# EAGLE design overall_pcb_1_1 (EAGLE 8.3.2)
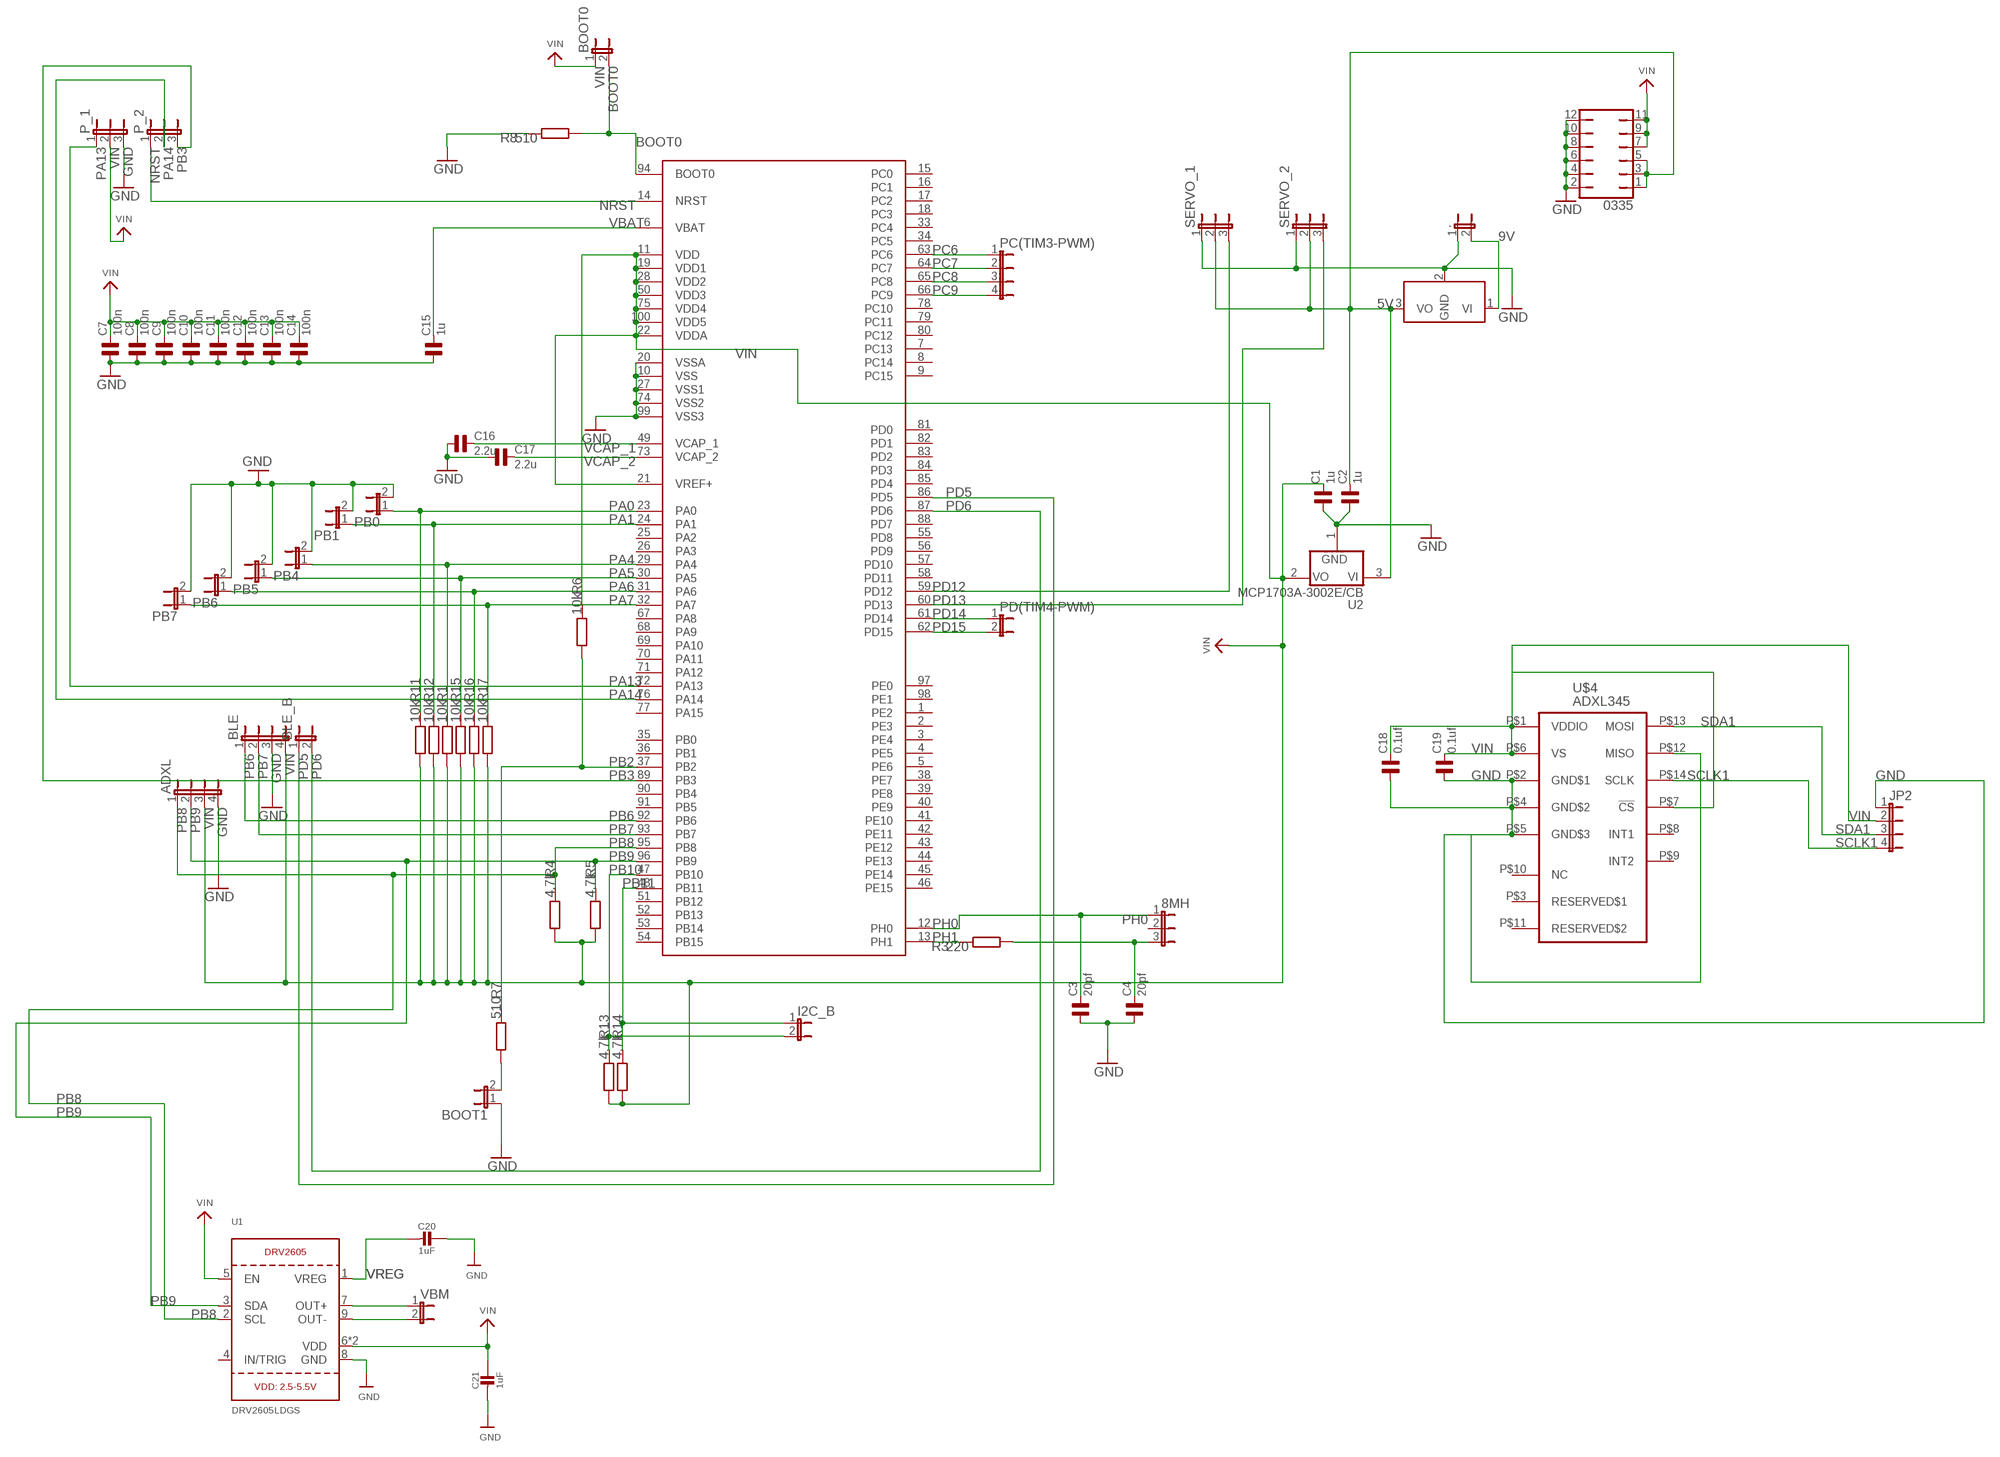
[diagram p0: schematic, sheet 1]

## Parts
8MH  JP2E  [JP2]
0335  JP6Q  [JP6Q]
.  JP1E  [JP1]
ADXL  JP4E  [JP4]
BLE  JP4E  [JP4]
BLE_B  JP1E  [JP1]
BOOT0  JP1E  [JP1]
BOOT1  JP1E  [JP1]
C1  1u  C0805  [0805]
C2  1u  C0805  [0805]
C3  20pf  C0805  [0805]
C4  20pf  C0805  [0805]
C7  100n  C0805  [0805]
C8  100n  C0805  [0805]
C9  100n  C0805  [0805]
C10  100n  C0805  [0805]
C11  100n  C0805  [0805]
C12  100n  C0805  [0805]
C13  100n  C0805  [0805]
C14  100n  C0805  [0805]
C15  1u  C0805  [0805]
C16  2.2u  C0805  [0805]
C17  2.2u  C0805  [0805]
C18  0.1uf  C0805  [0805]
C19  0.1uf  C0805  [0805]
C20  1uF  CAP_CERAMIC0805-NOOUTLINE  [0805-NO]
C21  1uF  CAP_CERAMIC0805-NOOUTLINE  [0805-NO]
I2C_B  JP1E  [JP1]
JP2  JP4E  [JP4]
P_1  JP2E  [JP2]
P_2  JP2E  [JP2]
PB0  JP1E  [JP1]
PB1  JP1E  [JP1]
PB4  JP1E  [JP1]
PB5  JP1E  [JP1]
PB6  JP1E  [JP1]
PB7  JP1E  [JP1]
PC(TIM3-PWM)  JP4E  [JP4]
PD(TIM4-PWM)  JP1E  [JP1]
R1  10k  R-EU_R0805  [R0805]
R3  220  R-EU_R0805  [R0805]
R4  4.7k  R-EU_R0805  [R0805]
R5  4.7k  R-EU_R0805  [R0805]
R6  10k  R-EU_R0805  [R0805]
R7  510  R-EU_R0805  [R0805]
R8  510  R-EU_R0805  [R0805]
R11  10k  R-EU_R0805  [R0805]
R12  10k  R-EU_R0805  [R0805]
R13  4.7k  R-EU_R0805  [R0805]
R14  4.7k  R-EU_R0805  [R0805]
R15  10k  R-EU_R0805  [R0805]
R16  10k  R-EU_R0805  [R0805]
R17  10k  R-EU_R0805  [R0805]
SERVO_1  JP2E  [JP2]
SERVO_2  JP2E  [JP2]
U1  DRV2605LDGS  DRV2605_SOP  [PSOP10]
U2  MCP1703A-3002E/CB  [SOT23A_MICROCHIP_CB]
U$1  STM32F40XSTM32D40X  [LQFP100]
U$2  DCDC_OKI-78SR  [OKI-78SRH]
U$4  ADXL345  [LGA14]
VBM  JP1E  [JP1]

## Nets
5V: 0335.1 0335.3 0335.5 C2.2 SERVO_1.2 SERVO_2.2 U2.3(VI) U$2.3(VO)
9V: ..2 U$2.1(VI)
BOOT0: BOOT0.2 R8.1 U$1.94(BOOT0)
GND: 0335.2 0335.4 0335.6 0335.8 0335.10 0335.12 ..1 ADXL.4 BLE.3 BOOT1.1 C1.1 C2.1 C3.1 C4.1 C7.1 C8.1 C9.1 C10.1 C11.1 C12.1 C13.1 C14.1 C15.1 C16.1 C17.1 C18.1 C19.1 C20.1 C21.2 JP2.1 P_1.3 PB0.2 PB1.2 PB4.2 PB5.2 PB6.2 PB7.2 R8.2 SERVO_1.1 SERVO_2.1 U1.8(GND) U2.1(GND) U$1.10(VSS) U$1.20(VSSA) U$1.27(VSS1) U$1.74(VSS2) U$1.99(VSS3) U$2.2(GND) U$4.P$2(GND$1) U$4.P$4(GND$2) U$4.P$5(GND$3) U$4.P$12(MISO)
N$2: BOOT1.2 R7.1
N$7: 8MH.3 C4.2 R3.1
NRST: P_2.1 U$1.14(NRST)
OUT+: U1.7(OUT+) VBM.1
OUT-: U1.9(OUT-) VBM.2
PA0: PB0.1 R11.2 U$1.23(PA0)
PA1: PB1.1 R12.2 U$1.24(PA1)
PA4: PB4.1 R1.2 U$1.29(PA4)
PA5: PB5.1 R15.2 U$1.30(PA5)
PA6: PB6.1 R16.2 U$1.31(PA6)
PA7: PB7.1 R17.2 U$1.32(PA7)
PA13: P_1.1 U$1.72(PA13)
PA14: P_2.2 U$1.76(PA14)
PB2: R6.1 R7.2 U$1.37(PB2)
PB3: P_2.3 U$1.89(PB3)
PB6: BLE.1 U$1.92(PB6)
PB7: BLE.2 U$1.93(PB7)
PB8: ADXL.1 R4.2 U1.2(SCL) U$1.95(PB8)
PB9: ADXL.2 R5.2 U1.3(SDA) U$1.96(PB9)
PB10: I2C_B.2 R13.2 U$1.47(PB10)
PB11: I2C_B.1 R14.2 U$1.48(PB11)
PC6: PC(TIM3-PWM).1 U$1.63(PC6)
PC7: PC(TIM3-PWM).2 U$1.64(PC7)
PC8: PC(TIM3-PWM).3 U$1.65(PC8)
PC9: PC(TIM3-PWM).4 U$1.66(PC9)
PD5: BLE_B.1 U$1.86(PD5)
PD6: BLE_B.2 U$1.87(PD6)
PD12: SERVO_1.3 U$1.59(PD12)
PD13: SERVO_2.3 U$1.60(PD13)
PD14: PD(TIM4-PWM).1 U$1.61(PD14)
PD15: PD(TIM4-PWM).2 U$1.62(PD15)
PH0: 8MH.1 C3.2 U$1.12(PH0)
PH1: R3.2 U$1.13(PH1)
SCLK1: JP2.4 U$4.P$14(SCLK)
SDA1: JP2.3 U$4.P$13(MOSI)
VBAT: C15.2 U$1.6(VBAT)
VCAP_1: C16.2 U$1.49(VCAP_1)
VCAP_2: C17.2 U$1.73(VCAP_2)
VIN: 0335.7 0335.9 0335.11 ADXL.3 BLE.4 BOOT0.1 C1.2 C7.2 C8.2 C9.2 C10.2 C11.2 C12.2 C13.2 C14.2 C18.2 C19.2 C21.1 JP2.2 P_1.2 R1.1 R4.1 R5.1 R6.2 R11.1 R12.1 R13.1 R14.1 R15.1 R16.1 R17.1 U1.5(EN) U1.6(VDD) U1.10(VDD) U2.2(VO) U$1.11(VDD) U$1.19(VDD1) U$1.21(VREF+) U$1.22(VDDA) U$1.28(VDD2) U$1.50(VDD3) U$1.75(VDD4) U$1.100(VDD5) U$4.P$1(VDDIO) U$4.P$6(VS) U$4.P$7(!CS)
VREG: C20.2 U1.1(VREG)
Unconnected: 8MH.2 U1.4(IN/TRIG) U$1.1(PE2) U$1.2(PE3) U$1.3(PE4) U$1.4(PE5) U$1.5(PE6) U$1.7(PC13) U$1.8(PC14) U$1.9(PC15) U$1.15(PC0) U$1.16(PC1) U$1.17(PC2) U$1.18(PC3) U$1.25(PA2) U$1.26(PA3) U$1.33(PC4) U$1.34(PC5) U$1.35(PB0) U$1.36(PB1) U$1.38(PE7) U$1.39(PE8) U$1.40(PE9) U$1.41(PE10) U$1.42(PE11) U$1.43(PE12) U$1.44(PE13) U$1.45(PE14) U$1.46(PE15) U$1.51(PB12) U$1.52(PB13) U$1.53(PB14) U$1.54(PB15) U$1.55(PD8) U$1.56(PD9) U$1.57(PD10) U$1.58(PD11) U$1.67(PA8) U$1.68(PA9) U$1.69(PA10) U$1.70(PA11) U$1.71(PA12) U$1.77(PA15) U$1.78(PC10) U$1.79(PC11) U$1.80(PC12) U$1.81(PD0) U$1.82(PD1) U$1.83(PD2) U$1.84(PD3) U$1.85(PD4) U$1.88(PD7) U$1.90(PB4) U$1.91(PB5) U$1.97(PE0) U$1.98(PE1) U$4.P$3(RESERVED$1) U$4.P$8(INT1) U$4.P$9(INT2) U$4.P$10(NC) U$4.P$11(RESERVED$2)

## Library data of the parts
8MH P_1 P_2 SERVO_1 SERVO_2 = jumper:JP2E: JUMPER
0335 = jumper:JP6Q: JUMPER
. BLE_B BOOT0 BOOT1 I2C_B PB0 PB1 PB4-PB7 PD(TIM4-PWM) VBM = jumper:JP1E: JUMPER
ADXL BLE JP2 PC(TIM3-PWM) = jumper:JP4E: JUMPER
C1-C4 C7-C19 = capsmd:C0805
C20 C21 = microbuilder:CAP_CERAMIC: Ceramic Capacitors For new designs, use the packages preceded by an '_' character since they are more reliable: The following footprints should be used on most boards: _0402 - Standard footprint for regular board layouts _0603 - Standard footprint for regular board layouts _0805 - Standard footprint for regular board layouts _1206 - Standard footprint for regular board layouts For extremely tight-pitch boards where space is at a premium, the following 'micro-pitch' footprints can be used (smaller pads, no silkscreen outline, etc.): _0402MP - Micro-pitch footprint for very dense/compact boards _0603MP - Micro-pitch footprint for very dense/compact boards _0805MP - Micro-pitch footprint for very dense/compact boards _1206MP - Micro-pitch footprint for very dense/compact boards
R1 R3-R8 R11-R17 = rcl:R-EU_: RESISTOR, European symbol
U1 = microbuilder:DRV2605: DRV2605 - Haptic Driver for ERM/LRA Motors
U2 = MCP1703:MCP1703*02E/CB: MCP1703[A] Series of Voltage Regulators – SOT23A (Microchip CB) (1.2 … 5.0)V, LDO, 16 V Input, 100/150/200/250 mA, Low Quiescent Current Source: http://ww1.microchip.com/downloads/en/DeviceDoc/22049f.pdf http://ww1.microchip.com/downloads/en/DeviceDoc/25122A.pdf Packages: SOT23, Microchip package identifier "CB" (dimensions and recommended land patterns acc. to Microchip) Technologies: MCP1703[A]T-xx02E/CB T : Tape and Reel xx: Output Voltage * 1000 mV; 12|15|18|25|28|30|33|40|50 0 : Extra Feature Code (fixed) 2 : Output volt. Tol.: ±2% (standard) E : Temperature range (−40…+125)°C CB: Package: SOT23A Author: Dipl.-Ing. FH Rainer Bayer HHN Hochschule Heilbronn, rainer.bayer@hs-heilbronn.de Ingenieurbüro ing-rb, mail@ing-rb.de
U$1 = stm32f:STM32F40X: Features • Core: ARM 32-bit Cortex™-M4 CPU with FPU, Adaptive real-time accelerator (ART Accelerator™) allowing 0-wait state execution from Flash memory, frequency up to 168 MHz, memory protection unit, 210 DMIPS/ 1.25 DMIPS/MHz (Dhrystone 2.1), and DSP instructions • Memories – Up to 1 Mbyte of Flash memory – Up to 192+4 Kbytes of SRAM including 64- Kbyte of CCM (core coupled memory) data RAM – Flexible static memory controller supporting Compact Flash, SRAM, PSRAM, NOR and NAND memories • LCD parallel interface, 8080/6800 modes • Clock, reset and supply management – 1.8 V to 3.6 V application supply and I/Os – POR, PDR, PVD and BOR – 4-to-26 MHz crystal oscillator – Internal 16 MHz factory-trimmed RC (1% accuracy) – 32 kHz oscillator for RTC with calibration – Internal 32 kHz RC with calibration • Low power – Sleep, Stop and Standby modes – VBAT supply for RTC, 20×32 bit backup registers + optional 4 KB backup SRAM • 3×12-bit, 2.4 MSPS A/D converters: up to 24 channels and 7.2 MSPS in triple interleaved mode • 2×12-bit D/A converters • General-purpose DMA: 16-stream DMA controller with FIFOs and burst support • Up to 17 timers: up to twelve 16-bit and two 32- bit timers up to 168 MHz, each with up to 4 IC/OC/PWM or pulse counter and quadrature (incremental) encoder input • Debug mode – Serial wire debug (SWD) & JTAG interfaces – Cortex-M4 Embedded Trace Macrocell™ • Up to 140 I/O ports with interrupt capability – Up to 136 fast I/Os up to 84 MHz – Up to 138 5 V-tolerant I/Os • Up to 15 communication interfaces – Up to 3 × I2C interfaces (SMBus/PMBus) – Up to 4 USARTs/2 UARTs (10.5 Mbit/s, ISO 7816 interface, LIN, IrDA, modem control) – Up to 3 SPIs (42 Mbits/s), 2 with muxed full-duplex I2S to achieve audio class accuracy via internal audio PLL or external clock – 2 × CAN interfaces (2.0B Active) – SDIO interface • Advanced connectivity – USB 2.0 full-speed device/host/OTG controller with on-chip PHY – USB 2.0 high-speed/full-speed device/host/OTG controller with dedicated DMA, on-chip full-speed PHY and ULPI – 10/100 Ethernet MAC with dedicated DMA: supports IEEE 1588v2 hardware, MII/RMII • 8- to 14-bit parallel camera interface up to 54 Mbytes/s • True random number generator • CRC calculation unit • 96-bit unique ID • RTC: subsecond accuracy, hardware calendar
U$2 = carrilib:DCDC_OKI-78SR: 4.95W DC/DC Converter Manufacturer: Murata Part Number: OKI-78SR-5/1.5-W36H-C OKI-78SR-3.3/1.5-W36H-C
U$4 = adxl345:ADXL345: 3-Axis, ±2 g/±4 g/±8 g/±16 g Digital Accelerometer

## Board
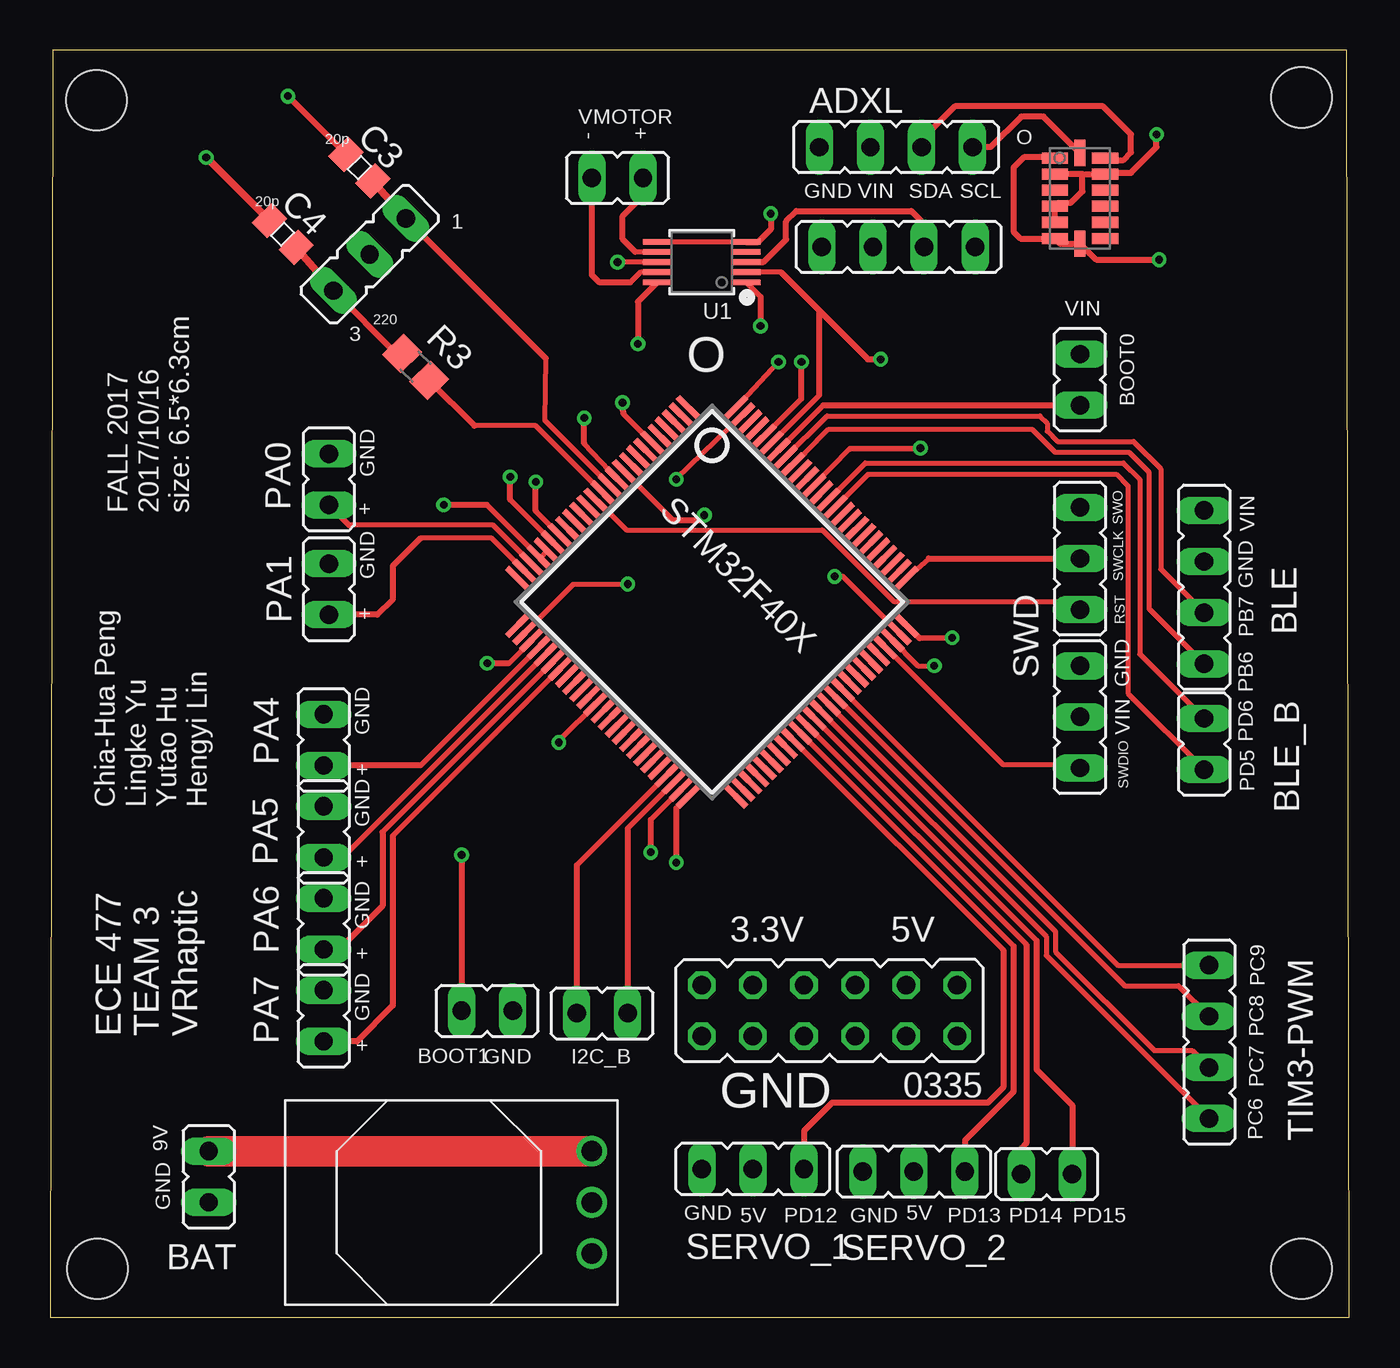
[diagram p1: board, top side]
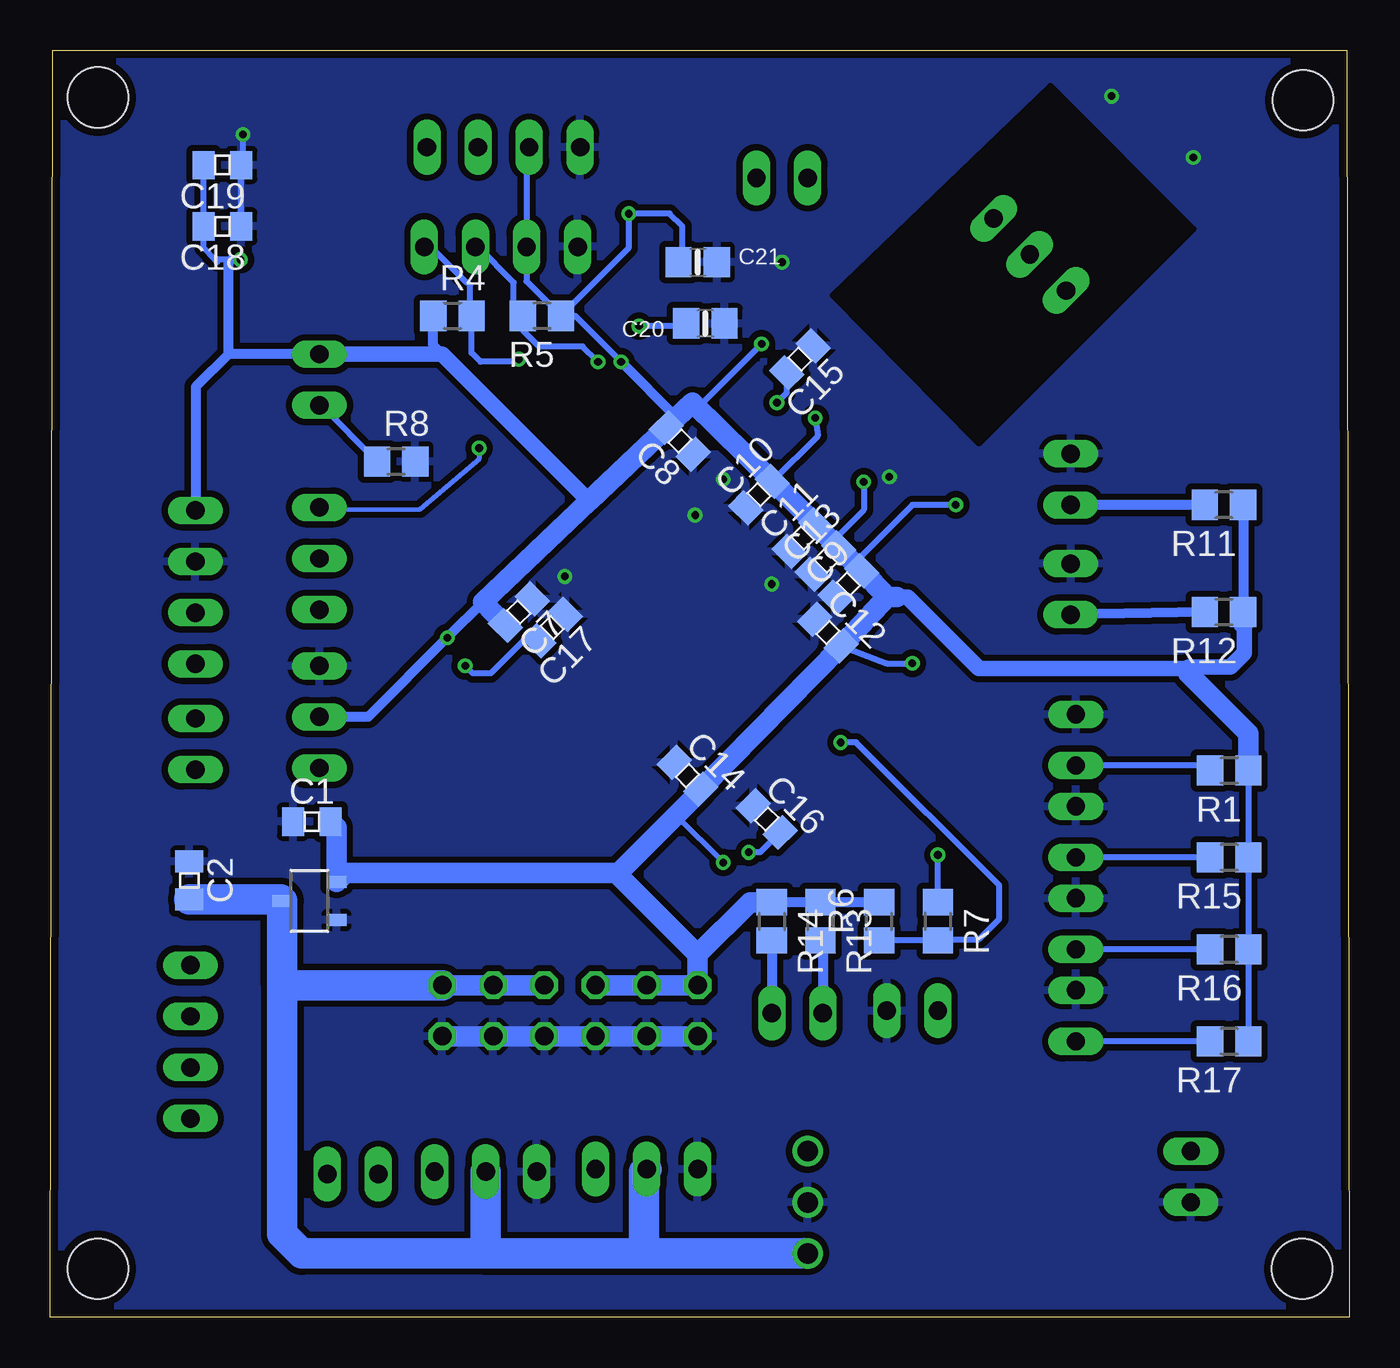
[diagram p2: board, bottom side, seen from below]

Size 64.57 x 62.98 mm. Coordinates in mm from the lower left corner, seen from the top.
Outline: 0,0 64.57,0 64.44,62.98 0.13,62.98 0,0
Copper layers (1*16): Top 0.0356mm / dielectric 1.5011mm / Bottom 0.0356mm
Design rules "ECE_Senior_Design *": minimum track width 8mil, minimum drill 13mil, track to track 8mil, track to pad 8mil, pad to pad 6mil, via to via 8mil, smd to smd 6mil, copper to edge 15mil, drill to drill 8mil, minimum pad ring 7mil, minimum via ring 7mil, stop-mask expansion 3mil, vias tented up to drill 0mil, thermal gap 10mil
Holes 3 mm at 2.29,60.5 62.2,60.63 62.2,2.41 2.34,2.41

### Footprints (pad centres in the part's own frame; a part is rotated, then mirrored left to right if it is on the bottom)
JP2 = drill 0.914 long: 1 -2.54,0; 2 0,0; 3 2.54,0
JP6Q = drill 0.914 octagon: 1 -6.35,-1.27; 2 -6.35,1.27; 3 -3.81,-1.27; 4 -3.81,1.27; 5 -1.27,-1.27; 6 -1.27,1.27; 7 1.27,-1.27; 8 1.27,1.27; 9 3.81,-1.27; 10 3.81,1.27; 11 6.35,-1.27; 12 6.35,1.27
JP1 = drill 0.914 long: 1 0,-1.27; 2 0,1.27
JP4 = drill 0.914 long: 1 -3.81,0; 2 -1.27,0; 3 1.27,0; 4 3.81,0
0805 = smd 1.092 x 1.397: 1 -0.94,0; 2 0.94,0
0805-NO = smd 1.3 x 1.5: 1 -0.95,0; 2 0.95,0
R0805 = smd 1.3 x 1.5: 1 -0.95,0; 2 0.95,0
PSOP10 = smd 0.28 x 1.45: 1 -1,-2.2; 2 -0.5,-2.2; 3 0,-2.2; 4 0.5,-2.2; 5 1,-2.2; 6 1,2.2; 7 0.5,2.2; 8 0,2.2; 9 -0.5,2.2; 10 -1,2.2
SOT23A_MICROCHIP_CB = smd 0.6 x 1: 1 -0.95,-1.35; 2 0.95,-1.35; 3 0,1.35
LQFP100 = smd 1.6 x 0.3: 1 -7.6,6; 2 -7.6,5.5; 3 -7.6,5; 4 -7.6,4.5; 5 -7.6,4; 6 -7.6,3.5; 7 -7.6,3; 8 -7.6,2.5; 9 -7.6,2; 10 -7.6,1.5; 11 -7.6,1; 12 -7.6,0.5; 13 -7.6,0; 14 -7.6,-0.5; 15 -7.6,-1; 16 -7.6,-1.5; 17 -7.6,-2; 18 -7.6,-2.5; 19 -7.6,-3; 20 -7.6,-3.5; 21 -7.6,-4; 22 -7.6,-4.5; 23 -7.6,-5; 24 -7.6,-5.5; 25 -7.6,-6; 51 7.6,-6; 52 7.6,-5.5; 53 7.6,-5; 54 7.6,-4.5; 55 7.6,-4; 56 7.6,-3.5; 57 7.6,-3; 58 7.6,-2.5; 59 7.6,-2; 60 7.6,-1.5; 61 7.6,-1; 62 7.6,-0.5; 63 7.6,0; 64 7.6,0.5; 65 7.6,1; 66 7.6,1.5; 67 7.6,2; 68 7.6,2.5; 69 7.6,3; 70 7.6,3.5; 71 7.6,4; 72 7.6,4.5; 73 7.6,5; 74 7.6,5.5; 75 7.6,6 | smd 0.3 x 1.6: 26 -6,-7.6; 27 -5.5,-7.6; 28 -5,-7.6; 29 -4.5,-7.6; 30 -4,-7.6; 31 -3.5,-7.6; 32 -3,-7.6; 33 -2.5,-7.6; 34 -2,-7.6; 35 -1.5,-7.6; 36 -1,-7.6; 37 -0.5,-7.6; 38 0,-7.6; 39 0.5,-7.6; 40 1,-7.6; 41 1.5,-7.6; 42 2,-7.6; 43 2.5,-7.6; 44 3,-7.6; 45 3.5,-7.6; 46 4,-7.6; 47 4.5,-7.6; 48 5,-7.6; 49 5.5,-7.6; 50 6,-7.6; 76 6,7.6; 77 5.5,7.6; 78 5,7.6; 79 4.5,7.6; 80 4,7.6; 81 3.5,7.6; 82 3,7.6; 83 2.5,7.6; 84 2,7.6; 85 1.5,7.6; 86 1,7.6; 87 0.5,7.6; 88 0,7.6; 89 -0.5,7.6; 90 -1,7.6; 91 -1.5,7.6; 92 -2,7.6; 93 -2.5,7.6; 94 -3,7.6; 95 -3.5,7.6; 96 -4,7.6; 97 -4.5,7.6; 98 -5,7.6; 99 -5.5,7.6; 100 -6,7.6
OKI-78SRH = drill 1.016: 1 2.54,0; 2 0,0; 3 -2.54,0
LGA14 = smd 1.3 x 0.55: P$1 -1.25,2; P$2 -1.25,1.2; P$3 -1.25,0.4; P$4 -1.25,-0.4; P$5 -1.25,-1.2; P$6 -1.25,-2; P$8 1.25,-2; P$9 1.25,-1.2; P$10 1.25,-0.4; P$11 1.25,0.4; P$12 1.25,1.2; P$13 1.25,2 | smd 0.55 x 1.3: P$7 0,-2.25; P$14 0,2.25

### Placement (x,y rotation side)
8MH  15.88,52.83 225 top
0335  38.73,15.24 180 top
.  7.87,6.99 0 top
ADXL  42.16,53.21 180 top
BLE  57.35,36.3 90 top
BLE_B  57.35,28.5 0 top
BOOT0  51.18,46.61 180 top
BOOT1  21.72,15.24 90 top
C1  51.56,24.64 0 bottom
C2  57.66,21.72 270 bottom
C3  15.37,57.15 315 top
C4  11.56,53.85 315 top
C7  41.27,35.05 225 bottom
C8  33.27,43.56 135 bottom
C9  24.89,36.45 45 bottom
C10  29.34,40.89 45 bottom
C11  27.18,38.73 45 bottom
C12  25.91,34.04 315 bottom
C13  26.04,37.59 45 bottom
C14  32.89,26.92 315 bottom
C15  27.3,47.62 225 bottom
C16  28.96,24.77 315 bottom
C17  39.62,34.29 225 bottom
C18  56.01,54.23 180 bottom
C19  56.01,57.28 180 bottom
C20  32,49.4 180 bottom
C21  32.38,52.45 0 bottom
I2C_B  27.43,15.11 90 top
JP2  42.04,58.17 0 top
P_1  51.18,29.84 90 top
P_2  51.18,37.72 90 top
PB0  13.84,41.66 0 top
PB1  13.84,36.2 0 top
PB4  13.59,28.7 0 top
PB5  13.59,24.13 0 top
PB6  13.59,19.56 0 top
PB7  13.59,14.99 0 top
PC(TIM3-PWM)  57.61,13.69 90 top
PD(TIM4-PWM)  49.53,7.11 270 top
R1  5.97,27.18 180 bottom
R3  18.16,47.24 315 top
R4  44.58,49.78 0 bottom
R5  40.13,49.78 180 bottom
R6  23.37,19.68 90 bottom
R7  20.45,19.68 270 bottom
R8  47.37,42.55 0 bottom
R11  6.22,40.39 180 bottom
R12  6.22,35.05 180 bottom
R13  26.29,19.68 270 bottom
R14  28.7,19.68 270 bottom
R15  5.97,22.86 180 bottom
R16  5.97,18.29 180 bottom
R17  5.97,13.72 180 bottom
SERVO_1  34.92,7.37 0 top
SERVO_2  42.93,7.24 0 top
U1  32.38,52.45 90 top
U2  51.69,20.7 90 bottom
U$1  32.89,35.56 315 top
U$2  26.92,5.71 90 top
U$4  51.18,55.63 0 top
VBM  28.19,56.64 90 top

### Tracks (layer width: path | path; a pad name or v marks a point on that pad's centre or on a via)
5V
  Bottom 1.016: 0335.5 0335.3 0335.1
  Bottom 1.524: 35.05,3.17 U$2.3 | 42.93,3.17 35.05,3.17 | 42.93,3.17 52.07,3.17 53.04,4.14 53.04,16.51 | 53.04,16.51 U2.3 53.12,20.78 C2.2 | SERVO_1.2 35.05,7.24 35.05,3.17 | SERVO_2.2 42.93,3.17 | 0335.1 53.04,16.51
8MHZ
  cutout Bottom (isolate 0.406): 7.75,54.1 14.86,61.21 25.68,50.8 18.41,43.43
9V
  Top 1.524: ..2 U$2.1
BOOT0
  Top 0.254: U$1.94 38.43,45.34
  Top 0.305: 38.43,45.34 BOOT0.2
  Bottom 0.305: R8.1 51.12,45.34 BOOT0.2
GND  (via drill 0.38)
  Top 0.254: U$1.99 v31.11,41.66 | U1.8 v28.19,52.45 | U$1.20 22.86,40.64 | U$1.10 28.59,41.99 30.96,39.62 | U$1.27 26,36.45 v28.7,36.45 | U$1.74 39.4,36.83 v38.99,36.83
  Top 0.305: 22.86,40.64 v22.86,41.78 | C3.1 v11.81,60.71 | v11.81,60.71 | U$4.P$5 U$4.P$4 50.1,55.4 50.73,55.4 51.31,55.98 51.31,56.83 | 51.31,56.83 U$4.P$2 | 51.31,56.83 U$4.P$12 52.5,56.9 53.72,56.9 54.99,58.17 v54.99,58.8 | 30.96,39.62 32.26,39.62 v32.51,39.88
  Top 0.381: C4.1 v7.75,57.66
  Bottom 0.305: C18.1 C19.1 54.99,57.35 v54.99,58.8
  Bottom 1.016: 0335.2 0335.4 0335.6 0335.8 0335.10 0335.12
  pour Bottom (isolate 0.305): 0.13,62.74 -0.13,-0.38 64.77,-0.51 64.52,62.87
N$2  (via drill 0.38)
  Top 0.305: v20.45,22.99 BOOT1.2
  Bottom 0.305: R7.1 v20.45,22.99
N$7
  Top 0.305: R3.1 17.2,47.92 8MH.3
  Top 0.381: 8MH.3 C4.2
NRST
  Top 0.254: U$1.14 27.19,40.58 28.63,39.14 38.38,39.14 41.94,35.59 50.77,35.59 P_2.1
OUT+
  Top 0.254: U1.7 29.08,52.96
  Top 0.305: 29.08,52.96 28.45,53.59 28.45,54.74 29.46,55.75 VBM.1
OUT-
  Top 0.254: U1.9 30.2,51.94 29.34,51.94 28.83,51.44
  Top 0.305: 28.83,51.44 27.3,51.44 26.92,51.82 VBM.2
PA0
  Top 0.254: U$1.23 24.12,37.27 22.02,39.37 14.86,39.37
  Top 0.305: 14.86,39.37 PB0.1
  Bottom 0.508: R11.2 PB0.1
PA1
  Top 0.254: U$1.24 21.94,38.73 18.41,38.73
  Top 0.305: 18.41,38.73 17.02,37.34 17.02,35.69 16.26,34.92 PB1.1
  Bottom 0.508: R12.2 PB1.1
PA4
  Top 0.254: U$1.29 18.4,27.43
  Top 0.305: 18.4,27.43 PB4.1
  Bottom 0.305: R1.2 7.17,27.43 PB4.1
PA5
  Top 0.254: U$1.30 14.54,22.86
  Top 0.305: 14.54,22.86 PB5.1
  Bottom 0.305: R15.2 PB5.1
PA6
  Top 0.254: U$1.31 16.51,24.13
  Top 0.305: PB6.1 14.35,18.29 16.51,20.45 16.51,24.13
  Bottom 0.305: R16.2 PB6.1
PA7
  Top 0.254: U$1.32 17.02,23.93
  Top 0.305: PB7.1 15.24,13.72 17.02,15.49 17.02,23.93
  Bottom 0.305: R17.2 PB7.1
PA13
  Top 0.254: U$1.72 47.35,27.48 51,27.48 P_1.1
PA14
  Top 0.254: 43.03,37.21 U$1.76 43.66,37.72
  Top 0.305: 43.66,37.72 P_2.2
PB2  (via drill 0.38)
  Top 0.254: U$1.37 25.27,28.65
  Top 0.305: 25.27,28.65 v25.27,28.57
  Bottom 0.305: R6.1 R7.2 20.38,18.8 18.41,18.8 17.4,19.81 17.4,21.46 24.51,28.57 v25.27,28.57
PB3  (via drill 0.38)
  Top 0.254: U$1.89 39.76,43.18
  Top 0.305: 39.76,43.18 v43.26,43.2 43.31,43.05
  Bottom 0.254: P_2.3 51.08,40.16 46.18,40.18 43.23,42.7 v43.26,43.2
PB6
  Top 0.254: U$1.92 36.88,42.35 37.53,43 37.54,43 38.68,44.15 48.79,44.15 49.94,43 53.62,43 54.61,42.01 54.61,35.23 BLE.1
PB7
  Top 0.254: U$1.93 38.61,44.81 49.2,44.81 49.55,44.45 49.55,44.04 50.06,43.54 53.85,43.54 55.19,42.19 55.19,37.19 BLE.2
PB8  (via drill 0.38)
  Top 0.254: U1.2 36.32,51.94 | U$1.95 38.23,45.84
  Top 0.305: 36.32,51.94 38.23,50.04 | 38.23,45.84 38.23,50.04 | 38.23,50.04 40.64,47.62 v41.27,47.62
  Bottom 0.305: v41.27,47.62 41.4,47.5 43.18,47.5 43.63,47.95 R4.2 43.69,49.84 43.69,51.31 43.81,51.44 43.88,51.44 45.65,53.21 ADXL.1
PB9  (via drill 0.38)
  Top 0.254: U$1.96 37.34,45.66
  Top 0.305: 37.34,45.66 v37.34,47.5 | U1.3 35.31,52.45 35.46,52.45 36.58,53.57 36.58,54.48 37.08,54.99 42.8,54.99 43.43,54.36 ADXL.2
  Bottom 0.305: v37.34,47.5 38.1,48.26 40.26,48.26 41.08,49.08 R5.2 41.53,50.23 41.53,51.44 43.31,53.21 ADXL.2
PB10
  Top 0.254: U$1.47 26.16,22.46
  Top 0.305: 26.16,22.46 I2C_B.2
  Bottom 0.508: R13.2 26.16,18.61 I2C_B.2
PB11
  Top 0.254: U$1.48 28.7,24.3
  Top 0.305: 28.7,24.3 I2C_B.1
  Bottom 0.508: R14.2 I2C_B.1
PC6
  Top 0.254: PC(TIM3-PWM).1 49.51,17.98 49.51,18.92 38.27,30.16 U$1.63
PC7
  Top 0.254: U$1.64 38.62,30.51 49.96,19.17 49.96,18.17 54.87,13.27 56.76,13.27 PC(TIM3-PWM).2
PC8
  Top 0.254: 38.97,30.86 U$1.65 39,30.89 53.41,16.48 56.08,16.48 PC(TIM3-PWM).3 57.4,15.16
PC9
  Top 0.254: U$1.66 39.33,31.23 53.06,17.5 PC(TIM3-PWM).4
PD5
  Top 0.254: U$1.86 38.98,40.23 40.66,41.91 52.98,41.91 53.57,41.33 53.57,31.01 BLE_B.1
PD6
  Top 0.254: U$1.87 40.51,42.47 53.34,42.47 54.15,41.66 54.15,32.97 BLE_B.2
PD12
  Top 0.254: U$1.59 47.37,18.25
  Top 0.305: 47.37,18.25 47.37,11.43 46.61,10.67 38.86,10.67 37.47,9.27 SERVO_1.3
PD13
  Top 0.254: U$1.60 47.88,18.45
  Top 0.305: SERVO_2.3 45.47,8.81 47.88,11.22 47.88,18.45
PD14
  Top 0.254: U$1.61 48.51,18.52
  Top 0.305: PD(TIM4-PWM).1 48.26,8.38 48.51,8.64 48.51,18.52
PD15
  Top 0.254: U$1.62 49.02,18.72
  Top 0.305: 49.02,18.72 49.02,12.32 50.8,10.54 PD(TIM4-PWM).2
PH0
  Top 0.254: U$1.12 27.82,41.34 24.59,44.58 24.64,47.66
  Top 0.305: 24.64,47.66 8MH.1
  Top 0.381: 8MH.1 C3.2
PH1
  Top 0.254: U$1.13 27.54,40.91 24.13,44.32 21.08,44.32
  Top 0.305: 21.08,44.32 R3.2
SCLK1
  Top 0.305: U$4.P$14 49.37,59.69 48.26,59.69 46.74,58.17 JP2.4
SDA1
  Top 0.305: U$4.P$13 52.53,57.53 53.34,57.53 53.72,57.91 53.72,58.8 52.32,60.2 44.96,60.2 43.31,58.55 JP2.3
VBAT  (via drill 0.38)
  Top 0.254: U$1.6 30.05,43.36 28.5,44.91
  Top 0.305: 28.5,44.91 v28.45,45.47
  Bottom 0.305: C15.2 27.97,45.94 v28.45,45.47
VCAP_1  (via drill 0.38)
  Top 0.254: U$1.49 29.84,24.73
  Top 0.305: 29.84,24.73 v29.84,23.11
  Bottom 0.305: C16.2 29.28,23.11 v29.84,23.11
VCAP_2  (via drill 0.38)
  Top 0.254: U$1.73 43.14,32.38 v43.94,32.38
  Bottom 0.305: C17.2 40.8,33.88 42.67,32 43.56,32 v43.94,32.38
VIN  (via drill 0.38)
  Top 0.254: v36.2,47.5 U$1.100 | U1.5 U1.6 | U$1.28 22.77,32.51 | U$1.50 31.11,25.3 | 21.7,40.39 U$1.22 U$1.21 | U$1.19 24.13,40.08 | U$1.11 28.21,41.64 26.54,43.43 | U$1.75 42.56,34.4
  Top 0.305: 22.77,32.51 v21.72,32.51 | U1.5 35.18,53.45 35.81,54.08 v35.81,54.86 | U1.10 29.21,50.48 v29.21,48.39 | 31.11,25.3 v31.11,22.61 | 21.7,40.39 v19.56,40.39 | 24.13,40.08 v24.13,41.53 | v55.12,52.58 51.98,52.58 U$4.P$7 50.18,53.38 U$4.P$6 48.23,53.63 47.88,53.98 47.88,57.15 48.39,57.66 49.9,57.66 U$4.P$1 50.04,57.73 | 26.54,43.43 v26.54,44.7 | 42.56,34.4 43.2,33.76 v44.83,33.78
  Bottom 0.254: v31.11,22.61 33.44,24.93 33.49,24.93
  Bottom 0.305: C12.2 22.99,32.51 v21.72,32.51 | R1.1 R15.1 R16.1 R17.1 | C21.1 33.15,52.64 33.15,54.23 33.78,54.86 v35.81,54.86 35.81,53.15 R5.1 | v29.21,48.39 32.13,45.47 32.64,45.47 | v36.2,47.5 38.48,49.78 R5.1 | R5.1 40.08,50.68 40.89,51.5 ADXL.3 40.89,58.04 JP2.2 | v19.56,40.39 21.72,40.39 24.35,37.75 24.86,37.75 | v24.13,41.53 24.13,40.13 25.5,38.77 25.88,38.77 | C19.2 C18.2 56.95,53.14 56.39,52.58 | v55.12,52.58 55.58,52.58 56.39,52.58 | 56.39,52.58 56.26,52.45 | v26.54,44.7 26.42,43.81 C10.2 | U2.2 50.62,21.93
  Bottom 0.508: R11.1 R12.1 | 43.05,35.56 v44.83,33.78 48.77,29.84 P_1.2 | 45.08,47.88 45.53,48.32 R4.1 | 32.26,26.23 C14.2 | R14.1 R13.1 R6.2 | v36.2,47.5 33.43,44.73 33.43,44.71 | BOOT0.1 55.7,47.88 | 55.7,47.88 57.33,46.25 57.33,40.13 BLE.4 | 55.7,47.88 55.7,52.45 55.58,52.58
  Bottom 0.762: 37.78,40.58 45.08,47.88 BOOT0.1 | C14.2 32.38,26.1 | 22.99,35.81 21.97,35.81 18.41,32.26 8.26,32.26 8,32 8,32.32 5.9,32.32 5.21,33.02 5.21,34.41 5.27,34.48
  Bottom 1.016: 22.99,35.81 C12.2 C14.2 32.23,26.19 33.49,24.93 36.32,22.1 | 22.99,35.81 C9.2 24.86,37.75 C13.2 25.88,38.77 C11.2 C10.2 32.64,45.47 33.43,44.71 C8.2 37.78,40.58 43.05,35.56 C7.2 | 0335.7 0335.9 0335.11 32.38,18.03 | 22.99,35.81 22.48,35.81 | R12.1 5.27,34.48 | R1.1 5.02,29.02 8,32 | C1.2 50.34,24.36 U2.2 49.89,22.1 36.32,22.1 | 36.32,22.1 36.32,21.97 32.38,18.03 | R14.1 29.78,20.64 32.38,18.03
VREG  (via drill 0.38)
  Top 0.254: U1.1 35.31,50.73
  Top 0.305: 35.31,50.73 v35.31,49.28
  Bottom 0.305: C20.2 33.08,49.28 v35.31,49.28

### Text on the board
tNames: ADXL | VMOTOR | - | + | 20p | O | GND | VIN | SDA | SCL | 20p | 1 | VIN | 3 | 220 | O | BOOT0 | GND | FALL 2017 / 2017/10/16 / size: 6.5*6.3cm | PA0 | + | SWO | VIN | GND | SWCLK | GND | PA1 | + | RST | PB7 | BLE | SWD | GND | PB6 | GND | VIN | PD6 | PA4 | + | SWDIO | PD5 | Chia-Hua Peng / Lingke Yu / Yutao Hu / Hengyi Lin | BLE_B | GND | PA5 | + | GND | 3.3V | 5V | PA6 | + | PC9 | GND | ECE 477 / TEAM 3 / VRhaptic | PA7 | PC8 | + | BOOT1 | GND | I2C_B | PC7 | GND | PC6 | TIM3-PWM | 9V | GND | GND | 5V | PD12 | GND | 5V | PD13 | PD14 | PD15 | BAT | SERVO_1 | SERVO_2
bTest: 0.1u | 0.1u | 4.7k | 4.7k | 1u | 510 | 100N | 10K | 100N | 100N | 100N | 2.2U | 10K | 10K | 2.2U | 510 | 10K | 1u | 1u | 4.7K | 4.7K | 10K | 10K | 10K